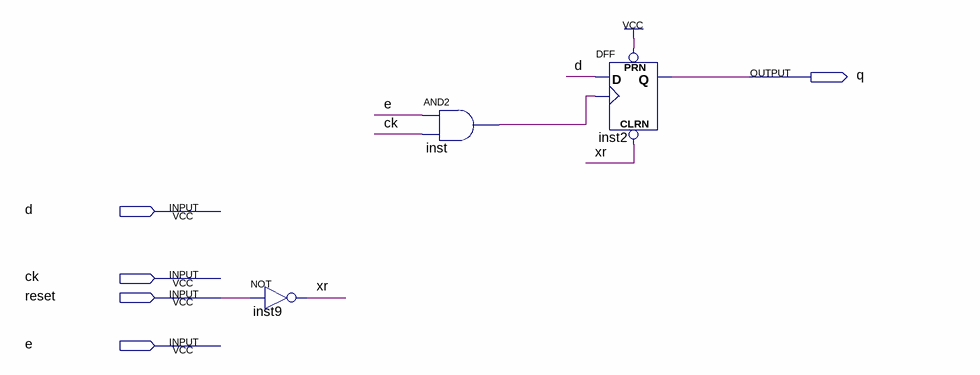
[diagram p0: schematic sheet]
// Quartus schematic pfs_reg.bdf as structural Verilog: 3 symbols, 5 pins
module pfs_reg (
  input  d,
  input  ck,
  input  reset,
  input  e,
  output q
);

  wire inst_out, xr;

  not inst9 (xr, reset);
  and inst (inst_out, e, ck);
  DFF inst2 (.CLRN(xr), .CLK(inst_out), .D(d), .PRN(1'b1), .Q(q));
endmodule
